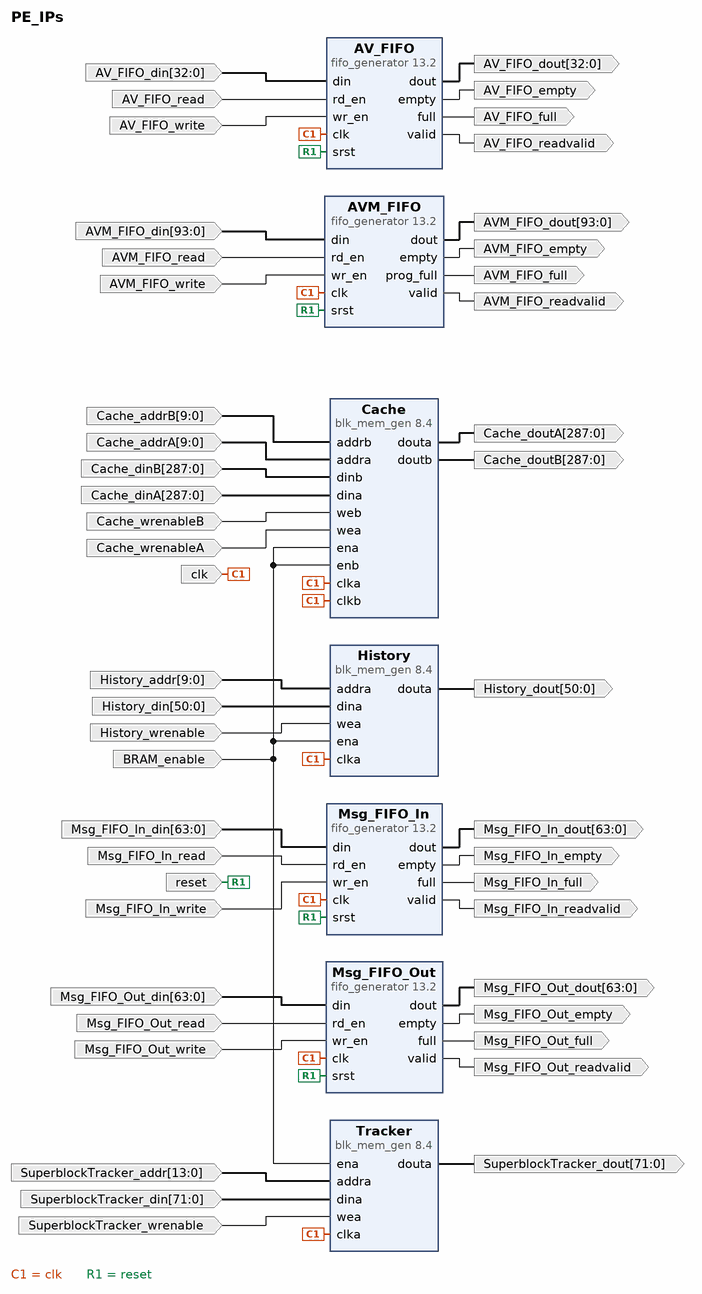
[diagram p0: block diagram of the top level]
# Vivado block design PE_IPs, xcu280-fsvh2892-2L-e, Vivado 2022.1
create_bd_design PE_IPs

create_bd_port -dir I BRAM_enable
create_bd_port -dir I SuperblockTracker_wrenable
create_bd_port -dir I Cache_wrenableA
create_bd_port -dir I History_wrenable
create_bd_port -dir I -from 13 -to 0 SuperblockTracker_addr
create_bd_port -dir I -from 71 -to 0 -type data SuperblockTracker_din
create_bd_port -dir O -from 71 -to 0 -type data SuperblockTracker_dout
create_bd_port -dir I -type clk clk
set_property -dict {CONFIG.FREQ_HZ 250000000} [get_bd_ports clk]
create_bd_port -dir I -from 9 -to 0 Cache_addrA
create_bd_port -dir I -from 287 -to 0 Cache_dinA
create_bd_port -dir I -from 9 -to 0 History_addr
create_bd_port -dir I -from 50 -to 0 History_din
create_bd_port -dir O -from 50 -to 0 -type data History_dout
create_bd_port -dir O -from 287 -to 0 -type data Cache_doutA
create_bd_port -dir I -type rst reset
set_property -dict {CONFIG.POLARITY ACTIVE_HIGH} [get_bd_ports reset]
create_bd_port -dir I -from 63 -to 0 -type data Msg_FIFO_Out_din
create_bd_port -dir O -from 63 -to 0 -type data Msg_FIFO_Out_dout
create_bd_port -dir I Msg_FIFO_Out_write
create_bd_port -dir I Msg_FIFO_Out_read
create_bd_port -dir O Msg_FIFO_Out_empty
create_bd_port -dir O Msg_FIFO_Out_full
create_bd_port -dir I -from 63 -to 0 -type data Msg_FIFO_In_din
create_bd_port -dir O -from 63 -to 0 -type data Msg_FIFO_In_dout
create_bd_port -dir I Msg_FIFO_In_write
create_bd_port -dir I Msg_FIFO_In_read
create_bd_port -dir O Msg_FIFO_In_empty
create_bd_port -dir O Msg_FIFO_In_full
create_bd_port -dir I -from 93 -to 0 -type data AVM_FIFO_din
create_bd_port -dir O -from 93 -to 0 -type data AVM_FIFO_dout
create_bd_port -dir I AVM_FIFO_write
create_bd_port -dir I AVM_FIFO_read
create_bd_port -dir O AVM_FIFO_empty
create_bd_port -dir O AVM_FIFO_full
create_bd_port -dir I -from 32 -to 0 -type data AV_FIFO_din
create_bd_port -dir O -from 32 -to 0 -type data AV_FIFO_dout
create_bd_port -dir I AV_FIFO_write
create_bd_port -dir I AV_FIFO_read
create_bd_port -dir O AV_FIFO_empty
create_bd_port -dir O AV_FIFO_full
create_bd_port -dir O AV_FIFO_readvalid
create_bd_port -dir O AVM_FIFO_readvalid
create_bd_port -dir O Msg_FIFO_Out_readvalid
create_bd_port -dir O Msg_FIFO_In_readvalid
create_bd_port -dir I -from 9 -to 0 Cache_addrB
create_bd_port -dir I -from 287 -to 0 Cache_dinB
create_bd_port -dir O -from 287 -to 0 -type data Cache_doutB
create_bd_port -dir I Cache_wrenableB

create_bd_cell -type ip -vlnv xilinx.com:ip:blk_mem_gen:8.4 Tracker
set_property -dict [list \
  CONFIG.Enable_32bit_Address false \
  CONFIG.Memory_Type Single_Port_RAM \
  CONFIG.Operating_Mode_A NO_CHANGE \
  CONFIG.PRIM_type_to_Implement URAM \
  CONFIG.Port_B_Clock 0 \
  CONFIG.Port_B_Enable_Rate 0 \
  CONFIG.Port_B_Write_Rate 0 \
  CONFIG.Use_Byte_Write_Enable false \
  CONFIG.Use_RSTA_Pin false \
  CONFIG.Write_Depth_A 16384 \
  CONFIG.Write_Width_A 72 \
  CONFIG.use_bram_block Stand_Alone \
] [get_bd_cells Tracker]
create_bd_cell -type ip -vlnv xilinx.com:ip:blk_mem_gen:8.4 Cache
set_property -dict [list \
  CONFIG.Enable_32bit_Address false \
  CONFIG.Memory_Type True_Dual_Port_RAM \
  CONFIG.PRIM_type_to_Implement URAM \
  CONFIG.Port_B_Clock 100 \
  CONFIG.Port_B_Enable_Rate 100 \
  CONFIG.Port_B_Write_Rate 50 \
  CONFIG.Use_Byte_Write_Enable false \
  CONFIG.Use_RSTA_Pin false \
  CONFIG.Write_Depth_A 1024 \
  CONFIG.Write_Width_A 288 \
  CONFIG.use_bram_block Stand_Alone \
] [get_bd_cells Cache]
create_bd_cell -type ip -vlnv xilinx.com:ip:blk_mem_gen:8.4 History
set_property -dict [list \
  CONFIG.Enable_32bit_Address false \
  CONFIG.Operating_Mode_A NO_CHANGE \
  CONFIG.PRIM_type_to_Implement URAM \
  CONFIG.Use_Byte_Write_Enable false \
  CONFIG.Use_RSTA_Pin false \
  CONFIG.Write_Depth_A 1024 \
  CONFIG.Write_Width_A 51 \
  CONFIG.use_bram_block Stand_Alone \
] [get_bd_cells History]
create_bd_cell -type ip -vlnv xilinx.com:ip:fifo_generator:13.2 Msg_FIFO_Out
set_property -dict {CONFIG.Input_Data_Width 64 CONFIG.Valid_Flag true} [get_bd_cells Msg_FIFO_Out]
create_bd_cell -type ip -vlnv xilinx.com:ip:fifo_generator:13.2 Msg_FIFO_In
set_property -dict [list \
  CONFIG.Input_Data_Width 64 \
  CONFIG.Performance_Options First_Word_Fall_Through \
  CONFIG.Valid_Flag true \
  CONFIG.enable_low_latency true \
] [get_bd_cells Msg_FIFO_In]
create_bd_cell -type ip -vlnv xilinx.com:ip:fifo_generator:13.2 AV_FIFO
set_property -dict {CONFIG.Input_Data_Width 33 CONFIG.Input_Depth 512 CONFIG.Valid_Flag true} [get_bd_cells AV_FIFO]
create_bd_cell -type ip -vlnv xilinx.com:ip:fifo_generator:13.2 AVM_FIFO
set_property -dict [list \
  CONFIG.Full_Threshold_Assert_Value 895 \
  CONFIG.Input_Data_Width 94 \
  CONFIG.Programmable_Full_Type Single_Programmable_Full_Threshold_Constant \
  CONFIG.Valid_Flag true \
] [get_bd_cells AVM_FIFO]

# ---- connections ----

connect_bd_net [get_bd_ports AVM_FIFO_din] [get_bd_pins AVM_FIFO/din]
connect_bd_net [get_bd_pins AVM_FIFO/dout] [get_bd_ports AVM_FIFO_dout]
connect_bd_net [get_bd_pins AVM_FIFO/empty] [get_bd_ports AVM_FIFO_empty]
connect_bd_net [get_bd_pins AVM_FIFO/prog_full] [get_bd_ports AVM_FIFO_full]
connect_bd_net [get_bd_ports AVM_FIFO_read] [get_bd_pins AVM_FIFO/rd_en]
connect_bd_net [get_bd_pins AVM_FIFO/valid] [get_bd_ports AVM_FIFO_readvalid]
connect_bd_net [get_bd_ports AVM_FIFO_write] [get_bd_pins AVM_FIFO/wr_en]
connect_bd_net [get_bd_ports AV_FIFO_din] [get_bd_pins AV_FIFO/din]
connect_bd_net [get_bd_pins AV_FIFO/dout] [get_bd_ports AV_FIFO_dout]
connect_bd_net [get_bd_pins AV_FIFO/empty] [get_bd_ports AV_FIFO_empty]
connect_bd_net [get_bd_pins AV_FIFO/full] [get_bd_ports AV_FIFO_full]
connect_bd_net [get_bd_ports AV_FIFO_read] [get_bd_pins AV_FIFO/rd_en]
connect_bd_net [get_bd_pins AV_FIFO/valid] [get_bd_ports AV_FIFO_readvalid]
connect_bd_net [get_bd_ports AV_FIFO_write] [get_bd_pins AV_FIFO/wr_en]
connect_bd_net [get_bd_ports BRAM_enable] [get_bd_pins Tracker/ena] [get_bd_pins Cache/ena] [get_bd_pins History/ena] [get_bd_pins Cache/enb]
connect_bd_net [get_bd_ports Cache_addrB] [get_bd_pins Cache/addrb]
connect_bd_net -net Cache_addr_1 [get_bd_ports Cache_addrA] [get_bd_pins Cache/addra]
connect_bd_net [get_bd_ports Cache_dinB] [get_bd_pins Cache/dinb]
connect_bd_net -net Cache_din_1 [get_bd_ports Cache_dinA] [get_bd_pins Cache/dina]
connect_bd_net [get_bd_pins Cache/douta] [get_bd_ports Cache_doutA]
connect_bd_net [get_bd_pins Cache/doutb] [get_bd_ports Cache_doutB]
connect_bd_net [get_bd_ports Cache_wrenableB] [get_bd_pins Cache/web]
connect_bd_net -net Cache_wrenable_1 [get_bd_ports Cache_wrenableA] [get_bd_pins Cache/wea]
connect_bd_net [get_bd_ports History_addr] [get_bd_pins History/addra]
connect_bd_net [get_bd_ports History_din] [get_bd_pins History/dina]
connect_bd_net [get_bd_pins History/douta] [get_bd_ports History_dout]
connect_bd_net [get_bd_ports History_wrenable] [get_bd_pins History/wea]
connect_bd_net [get_bd_ports Msg_FIFO_In_din] [get_bd_pins Msg_FIFO_In/din]
connect_bd_net [get_bd_pins Msg_FIFO_In/dout] [get_bd_ports Msg_FIFO_In_dout]
connect_bd_net [get_bd_pins Msg_FIFO_In/empty] [get_bd_ports Msg_FIFO_In_empty]
connect_bd_net [get_bd_pins Msg_FIFO_In/full] [get_bd_ports Msg_FIFO_In_full]
connect_bd_net [get_bd_ports Msg_FIFO_In_read] [get_bd_pins Msg_FIFO_In/rd_en]
connect_bd_net [get_bd_pins Msg_FIFO_In/valid] [get_bd_ports Msg_FIFO_In_readvalid]
connect_bd_net [get_bd_ports Msg_FIFO_In_write] [get_bd_pins Msg_FIFO_In/wr_en]
connect_bd_net [get_bd_ports Msg_FIFO_Out_din] [get_bd_pins Msg_FIFO_Out/din]
connect_bd_net [get_bd_pins Msg_FIFO_Out/dout] [get_bd_ports Msg_FIFO_Out_dout]
connect_bd_net [get_bd_pins Msg_FIFO_Out/empty] [get_bd_ports Msg_FIFO_Out_empty]
connect_bd_net [get_bd_pins Msg_FIFO_Out/full] [get_bd_ports Msg_FIFO_Out_full]
connect_bd_net [get_bd_ports Msg_FIFO_Out_read] [get_bd_pins Msg_FIFO_Out/rd_en]
connect_bd_net [get_bd_pins Msg_FIFO_Out/valid] [get_bd_ports Msg_FIFO_Out_readvalid]
connect_bd_net [get_bd_ports Msg_FIFO_Out_write] [get_bd_pins Msg_FIFO_Out/wr_en]
connect_bd_net -net Tracker_addr_1 [get_bd_ports SuperblockTracker_addr] [get_bd_pins Tracker/addra]
connect_bd_net -net Tracker_din_1 [get_bd_ports SuperblockTracker_din] [get_bd_pins Tracker/dina]
connect_bd_net [get_bd_pins Tracker/douta] [get_bd_ports SuperblockTracker_dout]
connect_bd_net -net Tracker_wrenable_1 [get_bd_ports SuperblockTracker_wrenable] [get_bd_pins Tracker/wea]
connect_bd_net [get_bd_ports clk] \
  [get_bd_pins Tracker/clka] [get_bd_pins Cache/clka] [get_bd_pins History/clka] [get_bd_pins Msg_FIFO_In/clk] \
  [get_bd_pins Msg_FIFO_Out/clk] [get_bd_pins AV_FIFO/clk] [get_bd_pins AVM_FIFO/clk] [get_bd_pins Cache/clkb]
connect_bd_net [get_bd_ports reset] \
  [get_bd_pins Msg_FIFO_In/srst] [get_bd_pins Msg_FIFO_Out/srst] [get_bd_pins AVM_FIFO/srst] [get_bd_pins AV_FIFO/srst]

validate_bd_design
save_bd_design
